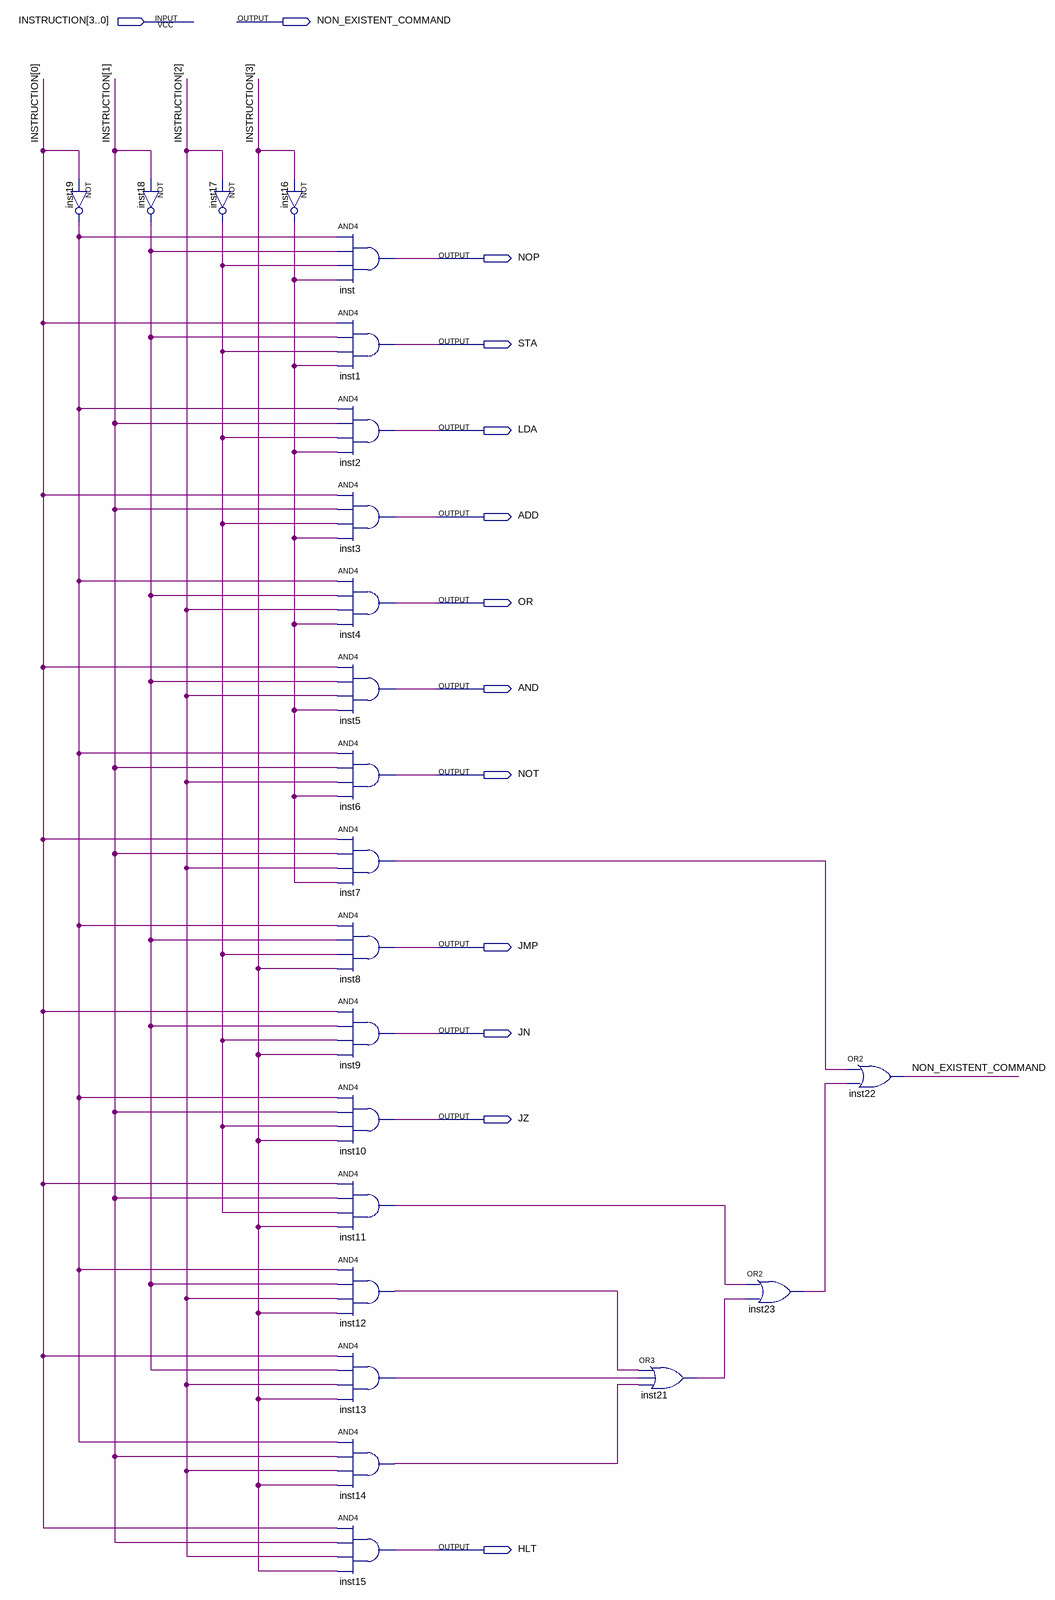
[diagram p0: schematic sheet]
// Quartus schematic INSTRUCTION_DECODER.bdf as structural Verilog: 23 symbols, 13 pins
module INSTRUCTION_DECODER (
  input  [3:0] INSTRUCTION,
  output NON_EXISTENT_COMMAND,
  output NOP,
  output STA,
  output LDA,
  output ADD,
  output OR,
  output AND,
  output NOT,
  output JMP,
  output JN,
  output JZ,
  output HLT
);

  wire inst7_out, inst11_out, inst12_out, inst13_out, inst14_out, inst16_out, inst17_out, inst18_out,
       inst19_out, inst21_out, inst23_out;

  not inst19 (inst19_out, INSTRUCTION[0]);
  not inst18 (inst18_out, INSTRUCTION[1]);
  not inst17 (inst17_out, INSTRUCTION[2]);
  not inst16 (inst16_out, INSTRUCTION[3]);
  and inst (NOP, inst19_out, inst18_out, inst17_out, inst16_out);
  and inst1 (STA, INSTRUCTION[0], inst18_out, inst17_out, inst16_out);
  and inst2 (LDA, inst19_out, INSTRUCTION[1], inst17_out, inst16_out);
  and inst3 (ADD, INSTRUCTION[0], INSTRUCTION[1], inst17_out, inst16_out);
  and inst4 (OR, inst19_out, inst18_out, INSTRUCTION[2], inst16_out);
  and inst5 (AND, INSTRUCTION[0], inst18_out, INSTRUCTION[2], inst16_out);
  and inst6 (NOT, inst19_out, INSTRUCTION[1], INSTRUCTION[2], inst16_out);
  and inst7 (inst7_out, INSTRUCTION[0], INSTRUCTION[1], INSTRUCTION[2], inst16_out);
  and inst8 (JMP, inst19_out, inst18_out, inst17_out, INSTRUCTION[3]);
  and inst9 (JN, INSTRUCTION[0], inst18_out, inst17_out, INSTRUCTION[3]);
  and inst10 (JZ, inst19_out, INSTRUCTION[1], inst17_out, INSTRUCTION[3]);
  and inst11 (inst11_out, INSTRUCTION[0], INSTRUCTION[1], inst17_out, INSTRUCTION[3]);
  and inst12 (inst12_out, inst19_out, inst18_out, INSTRUCTION[2], INSTRUCTION[3]);
  and inst13 (inst13_out, INSTRUCTION[0], inst18_out, INSTRUCTION[2], INSTRUCTION[3]);
  and inst14 (inst14_out, inst19_out, INSTRUCTION[1], INSTRUCTION[2], INSTRUCTION[3]);
  and inst15 (HLT, INSTRUCTION[0], INSTRUCTION[1], INSTRUCTION[2], INSTRUCTION[3]);
  or inst21 (inst21_out, inst12_out, inst13_out, inst14_out);
  or inst23 (inst23_out, inst11_out, inst21_out);
  or inst22 (NON_EXISTENT_COMMAND, inst7_out, inst23_out);
endmodule
